# EAGLE design ATtiny1634 (EAGLE 6.5.0)
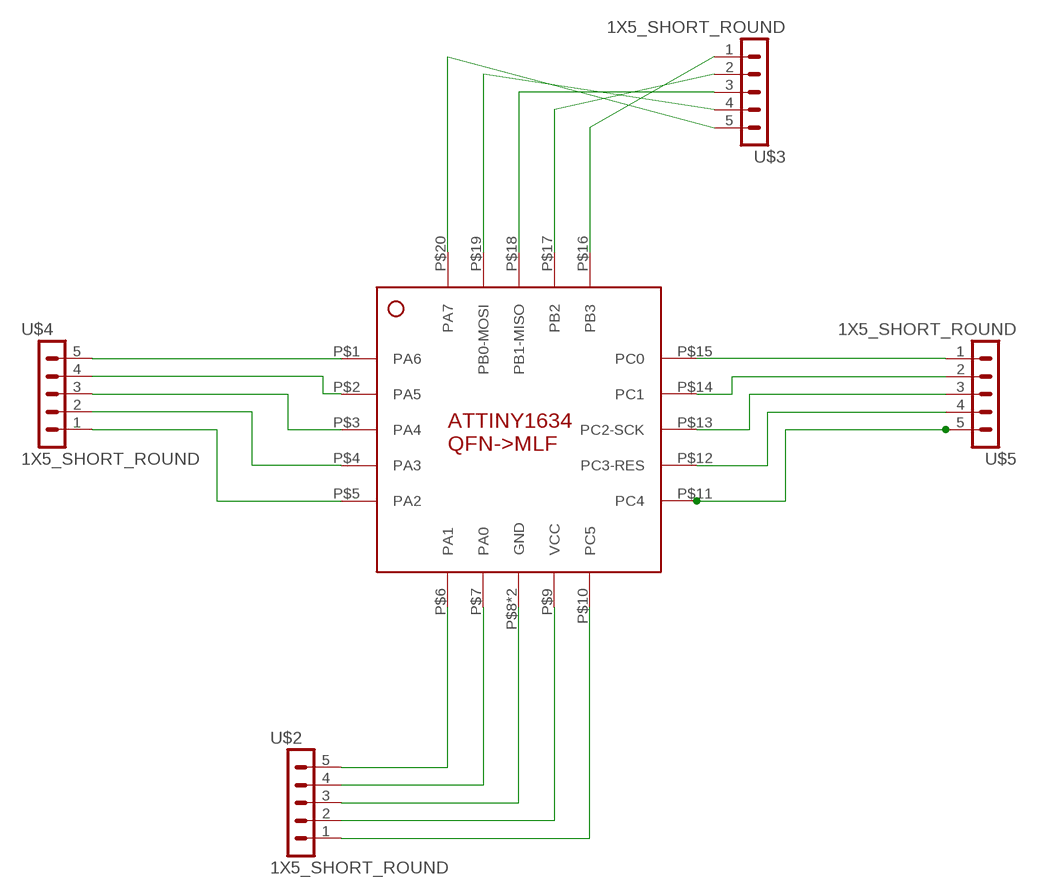
[diagram p0: schematic, sheet 1]

## Parts
U$1  ATTINY1634  [MLF20/ATTINY13]
U$2  1X5_SHORT_ROUND  [1X5_SHORT_ROUND]
U$3  1X5_SHORT_ROUND  [1X5_SHORT_ROUND]
U$4  1X5_SHORT_ROUND  [1X5_SHORT_ROUND]
U$5  1X5_SHORT_ROUND  [1X5_SHORT_ROUND]

## Nets
GND: U$1.P$8(GND) U$1.P$21(GND) U$2.3
PA0: U$1.P$7(PA0) U$2.4
PA1: U$1.P$6(PA1) U$2.5
PA2: U$1.P$5(PA2) U$4.1
PA3: U$1.P$4(PA3) U$4.2
PA4: U$1.P$3(PA4) U$4.3
PA5: U$1.P$2(PA5) U$4.4
PA6: U$1.P$1(PA6) U$4.5
PA7: U$1.P$20(PA7) U$3.5
PB0-MOSI: U$1.P$19(PB0-MOSI) U$3.4
PB1-MIS0: U$1.P$18(PB1-MISO) U$3.3
PB2: U$1.P$17(PB2) U$3.2
PB3: U$1.P$16(PB3) U$3.1
PC0: U$1.P$15(PC0) U$5.1
PC1: U$1.P$14(PC1) U$5.2
PC2-SCK: U$1.P$13(PC2-SCK) U$5.3
PC3-RES: U$1.P$12(PC3-RES) U$5.4
PC4: U$1.P$11(PC4) U$5.5
PC5: U$1.P$10(PC5) U$2.1
VCC: U$1.P$9(VCC) U$2.2

## Library data of the parts
U$1 = avr-5:ATTINY1634
U$2-U$5 = Random parts(01-14-14):1X5_SHORT_ROUND

## Board
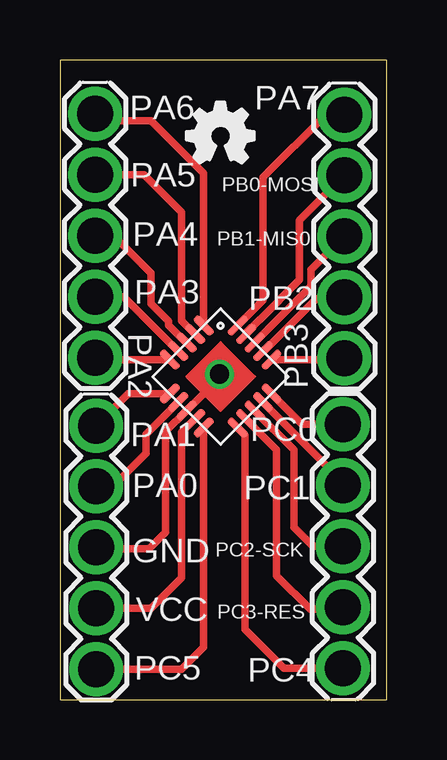
[diagram p1: board, top side]
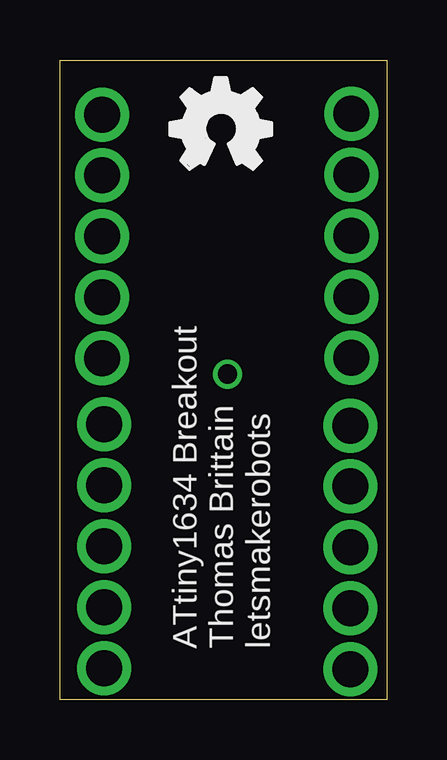
[diagram p2: board, bottom side, seen from below]

Size 13.64 x 26.66 mm. Coordinates in mm from the lower left corner, seen from the top.
Outline: 0,0 13.64,0 13.64,26.66 0,26.66 0,0
Copper layers (1*16): Top 0.035mm / dielectric 1.5mm / Bottom 0.035mm
Design rules "default": minimum track width 10mil, minimum drill 24mil, track to track 8mil, track to pad 8mil, pad to pad 8mil, via to via 8mil, smd to smd 8mil, copper to edge 40mil, drill to drill 8mil, minimum pad ring 10mil, minimum via ring 8mil, stop-mask expansion 4mil, vias tented up to drill 0mil, thermal gap 10mil

### Footprints (pad centres in the part's own frame; a part is rotated, then mirrored left to right if it is on the bottom)
MLF20/ATTINY13 = smd 1 x 0.3: P$1 -2,1; P$2 -2,0.5; P$3 -2,0; P$4 -2,-0.5; P$5 -2,-1; P$11 2,-1; P$12 2,-0.5; P$13 2,0; P$14 2,0.5; P$15 2,1 | smd 0.3 x 1: P$6 -1,-2; P$7 -0.5,-2; P$8 0,-2; P$9 0.5,-2; P$10 1,-2; P$16 1,2; P$17 0.5,2; P$18 0,2; P$19 -0.5,2; P$20 -1,2 | smd 0.813 x 0.406: P$21 0,0
1X5_SHORT_ROUND = drill 1.5 pad 2.2: 1 1.27,-1.52; 2 3.81,-1.52; 3 6.35,-1.52; 4 8.89,-1.52; 5 11.43,-1.52

### Placement (x,y rotation side)
U$1  6.7,13.47 315 top
U$2  0,0 90 top
U$3  10.35,12.96 90 top
U$4  -0.04,12.99 90 top
U$5  13.33,12.75 270 top
U$6  [OSHW_FILLX150_NOTEXT]  9.05,22.11 0 bottom
U$7  [OSHW_FILLX100_NOTEXT]  5.28,22.37 0 top

### Tracks (layer width: path | path; a pad name or v marks a point on that pad's centre or on a via)
GND
  Top 0.305: U$1.P$21 U$1.P$8 5.28,12.05 4.41,11.19 4.41,6.99 3.72,6.3 1.57,6.3 U$2.3
N$21  (via drill 0.8)
  other vias: 6.65,13.58
PA0
  Top 0.305: U$2.4 2.22,8.89 3.6,10.27 3.6,11.07 U$1.P$7
PA1
  Top 0.305: U$1.P$6 2.85,12.76 U$2.5
PA2
  Top 0.305: U$1.P$5 1.56,14.18 U$4.1
PA3
  Top 0.305: U$4.2 2.66,16.8 U$1.P$4
PA4
  Top 0.305: U$4.3 1.77,19.05 2.54,19.05 3.81,17.78 3.81,16.51 4.54,15.78 4.54,15.61 5.26,14.88 U$1.P$3
PA5
  Top 0.305: U$4.4 3.52,21.88 5.08,20.32 5.08,15.8 U$1.P$2
PA6
  Top 0.305: U$1.P$1 6,21.95 3.81,24.13 1.77,24.13 U$4.5
PA7
  Top 0.305: U$3.5 11.09,24.39 8.48,21.78 8.48,16.66 U$1.P$20
PB0-MOSI
  Top 0.305: U$1.P$19 7.76,15.29 8.31,15.84 8.33,15.84 10,17.5 10,19.98 U$3.4
PB1-MIS0
  Top 0.305: U$1.P$18 10.48,17.24 10.48,17.91 U$3.3
PB2
  Top 0.305: U$1.P$17 8.5,14.53 10.69,16.72 11.82,16.72 U$3.2
PB3
  Top 0.305: U$1.P$16 11.82,14.18 U$3.1
PC0
  Top 0.305: U$5.1 10.1,11.48 U$1.P$15
PC1
  Top 0.305: U$5.2 11.81,9.07 U$1.P$14
PC2-SCK
  Top 0.305: U$5.3 10.54,6.4 9.76,7.19 9.76,10.41 U$1.P$13
PC3-RES
  Top 0.305: U$1.P$12 9.04,10.42 9.04,5.18 10.45,3.77 11.72,3.77 U$5.4
PC4
  Top 0.305: U$5.5 9.33,1.32 7.72,2.93 7.72,11.03 U$1.P$11
PC5
  Top 0.305: U$1.P$10 6,2.19 5.08,1.27 U$2.1
VCC
  Top 0.305: U$2.2 3.81,3.81 5.08,5.08 5.08,11.14 U$1.P$9

### Text on the board
_tsilk: PA7 | PA6 | PA5 | PB0-MOSI | PA4 | PB1-MIS0 | PA3 | PB2 | PA2 | PB3 | PA1 | PC0 | PA0 | PC1 | GND | PC2-SCK | VCC | PC3-RES | PC5 | PC4
_bsilk: ATtiny1634 Breakout / Thomas Brittain / letsmakerobots